# EAGLE design RasPi-BplusHAT (EAGLE 9.4.2)
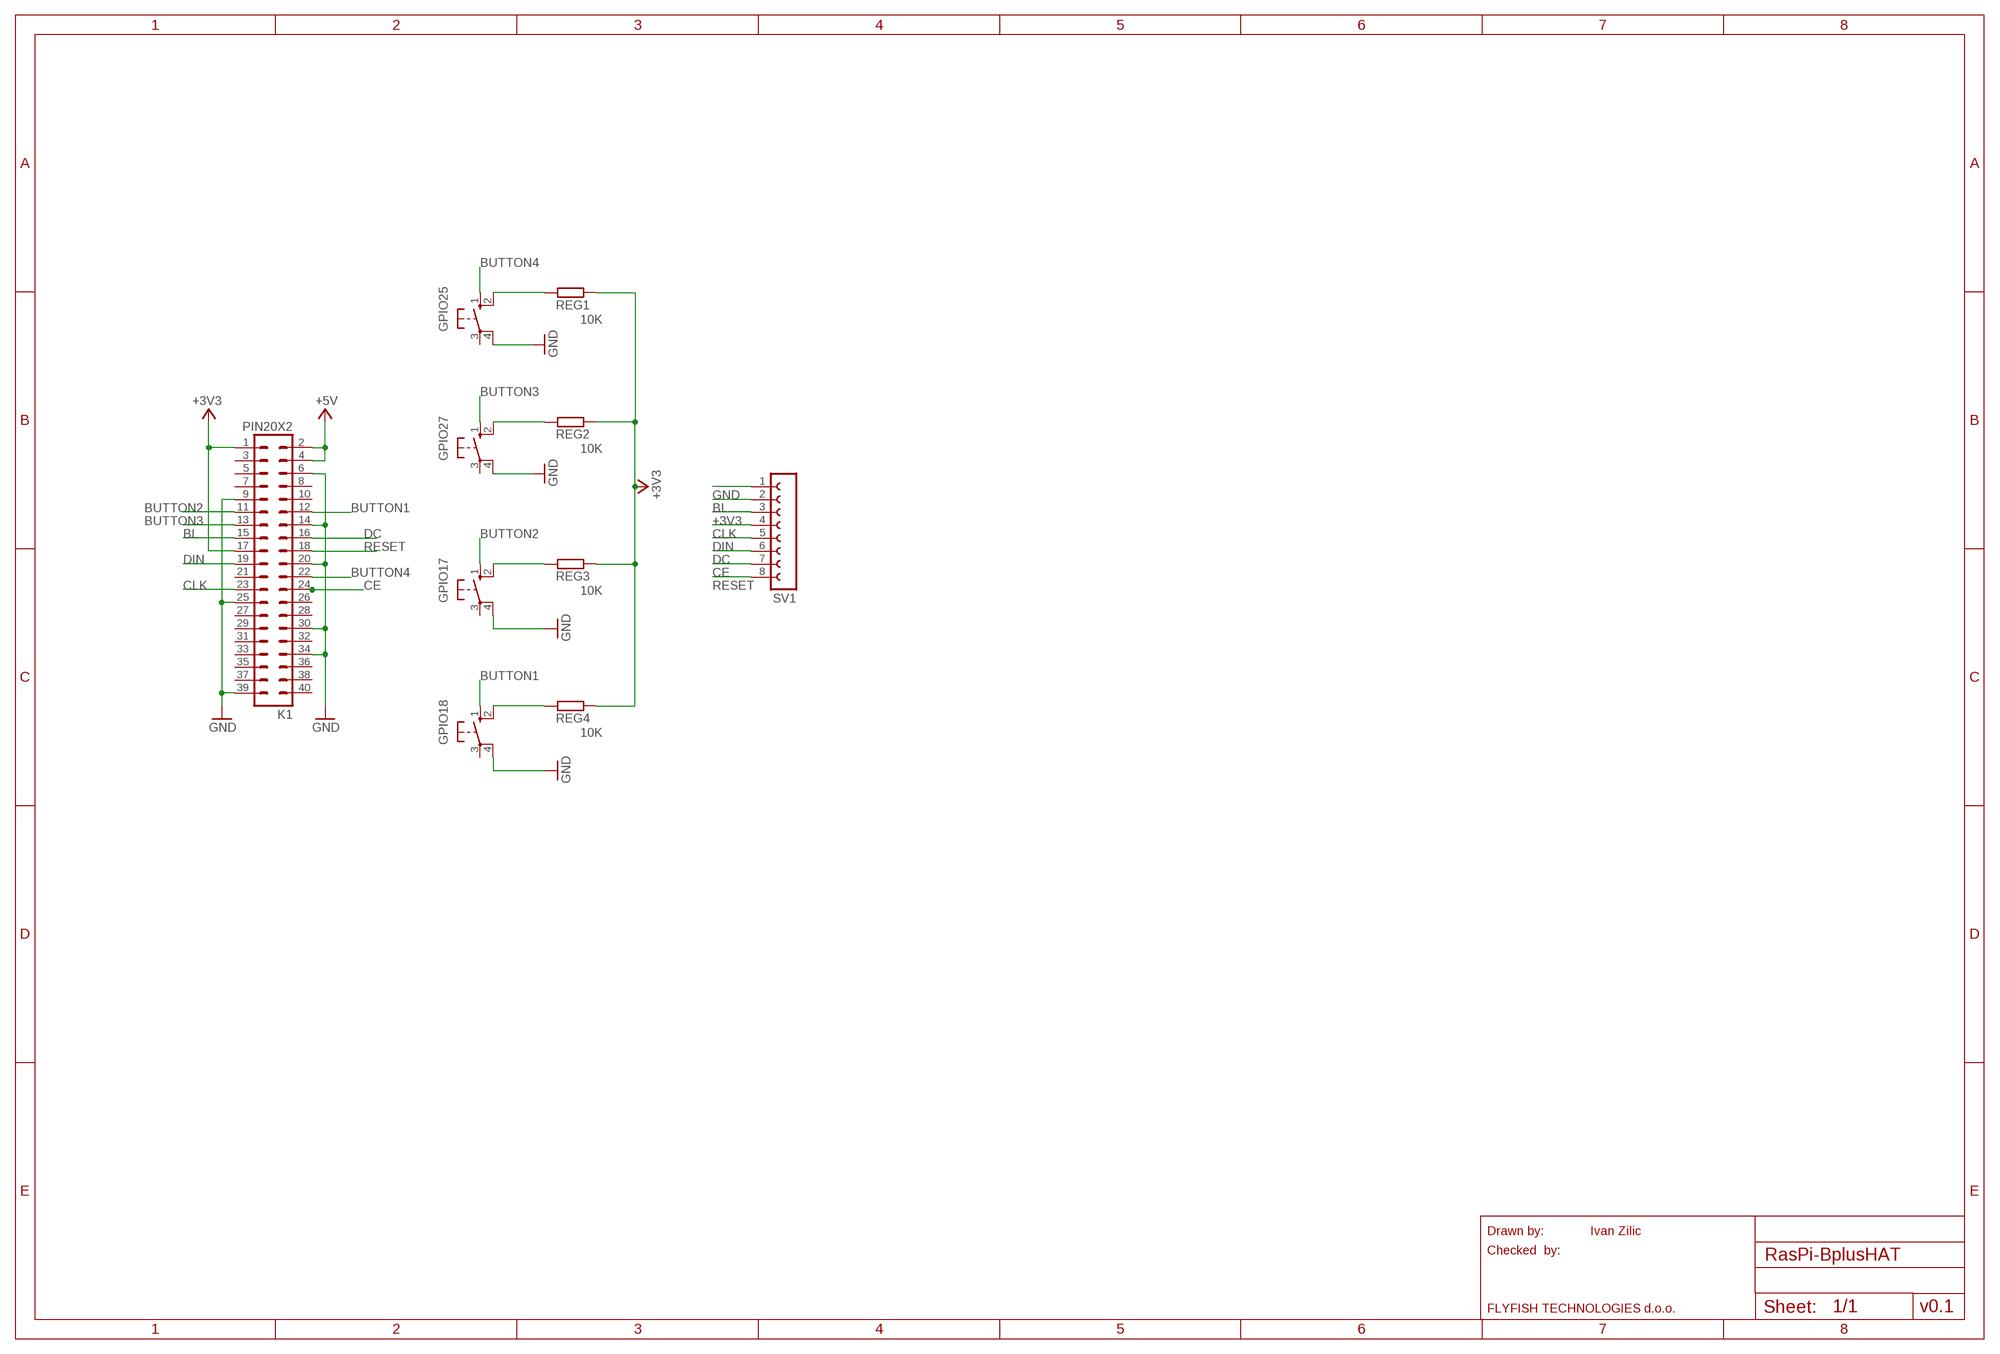
[diagram p0: schematic, sheet 1]

## Parts
GPIO17  10-XX  [B3F-10XX]
GPIO18  10-XX  [B3F-10XX]
GPIO25  10-XX  [B3F-10XX]
GPIO27  10-XX  [B3F-10XX]
K1  PIN20X2  [PIN_20X2]
REG1  10K  R-EU_0204/7  [0204/7]
REG2  10K  R-EU_0204/7  [0204/7]
REG3  10K  R-EU_0204/7  [0204/7]
REG4  10K  R-EU_0204/7  [0204/7]
SV1  FE08-1  [FE08]

## Nets
+3V3: K1.1 K1.17 REG1.1 REG2.1 REG3.1 REG4.1 SV1.3
+5V: K1.2 K1.4
BL: K1.15 SV1.2
BUTTON1: GPIO18.1(S) K1.12
BUTTON2: GPIO17.1(S) K1.11
BUTTON3: GPIO27.1(S) K1.13
BUTTON4: GPIO25.1(S) K1.22
CE: K1.24 SV1.7
CLK: K1.23 SV1.4
DC: K1.16 SV1.6
DIN: K1.19 SV1.5
GND: GPIO17.4(P1) GPIO18.4(P1) GPIO25.4(P1) GPIO27.4(P1) K1.6 K1.9 K1.14 K1.20 K1.25 K1.30 K1.34 K1.39 SV1.1
N$1: GPIO25.2(S1) REG1.2
N$2: GPIO27.2(S1) REG2.2
N$3: GPIO17.2(S1) REG3.2
N$4: GPIO18.2(S1) REG4.2
RESET: K1.18 SV1.8
Unconnected: GPIO17.3(P) GPIO18.3(P) GPIO25.3(P) GPIO27.3(P) K1.3 K1.5 K1.7 K1.8 K1.10 K1.21 K1.26 K1.27 K1.28 K1.29 K1.31 K1.32 K1.33 K1.35 K1.36 K1.37 K1.38 K1.40

## Notes on the sheet
- Drawn by: | Ivan Zilic
- Checked  by:
- FLYFISH TECHNOLOGIES d.o.o. | v0.1

## Library data of the parts
GPIO17 GPIO18 GPIO25 GPIO27 = switch-omron:10-XX: OMRON SWITCH; MPN: B3F-1000; OC_FARNELL: 176432; OC_NEWARK: 36M3542
K1 = FLYFISH:PIN20X2
REG1-REG4 = resistor:R-EU_: RESISTOR, European symbol
SV1 = con-lsta:FE08-1: FEMALE HEADER; OC_FARNELL: unknown; OC_NEWARK: unknown

## Net classes
0 default: width 0.305 mm, drill 0.381 mm, clearance 0.305 mm

## Board
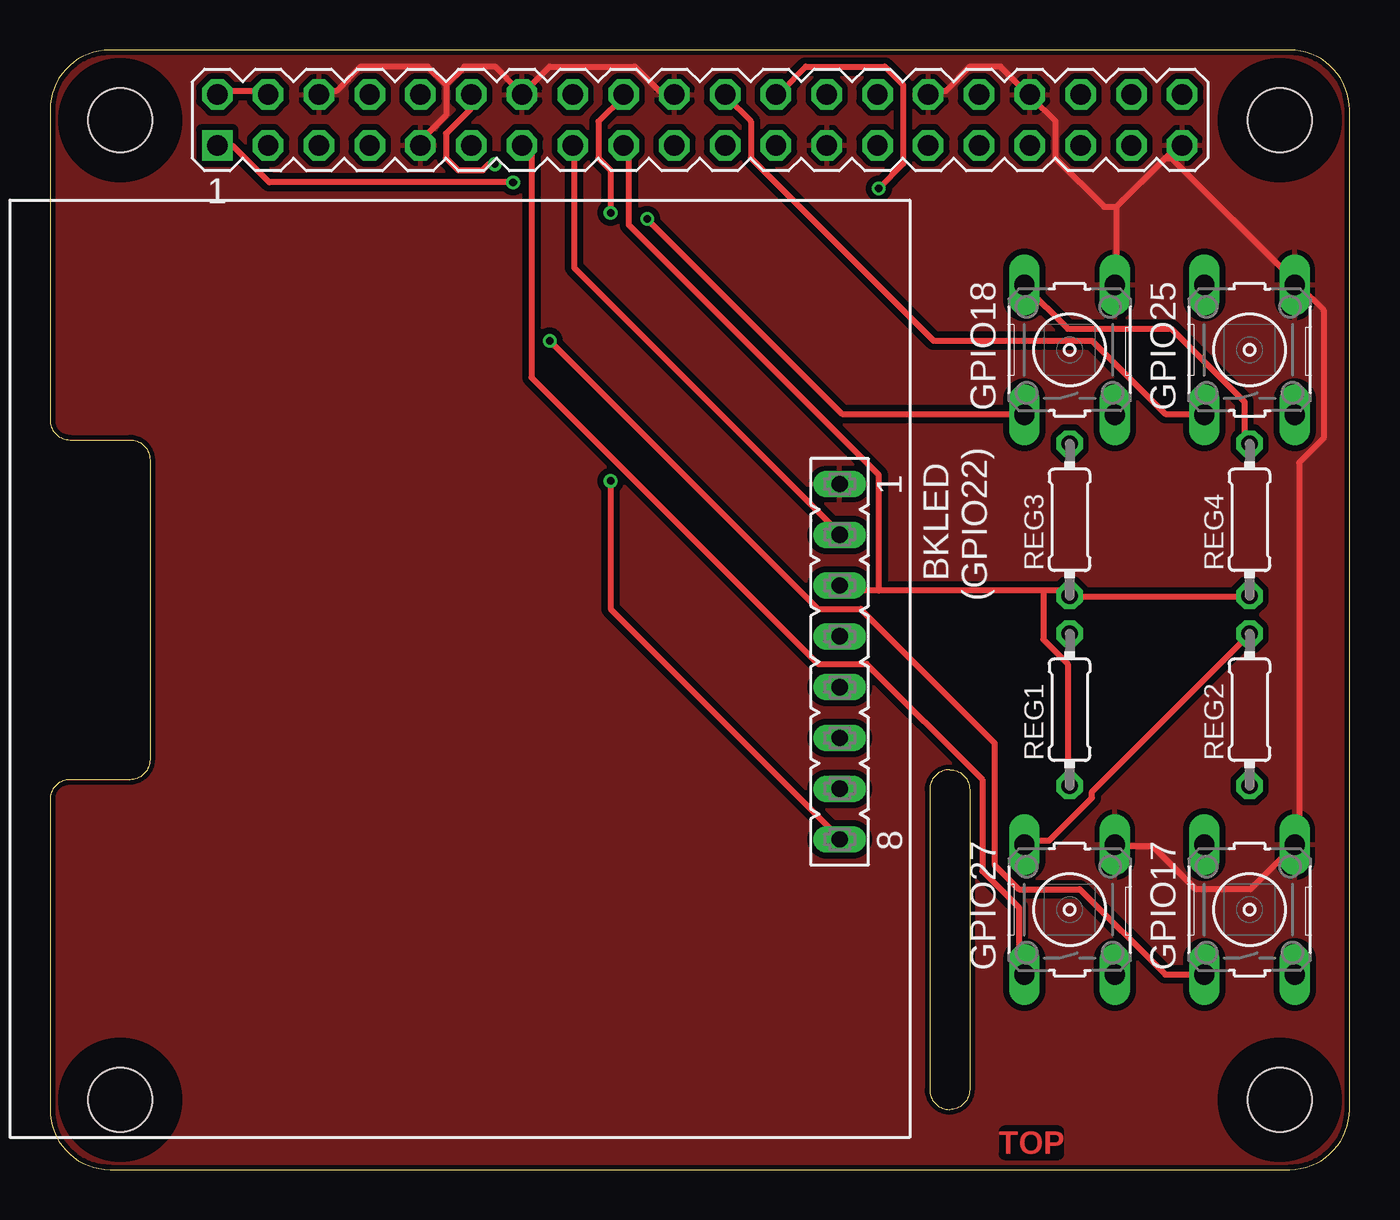
[diagram p1: board, top side]
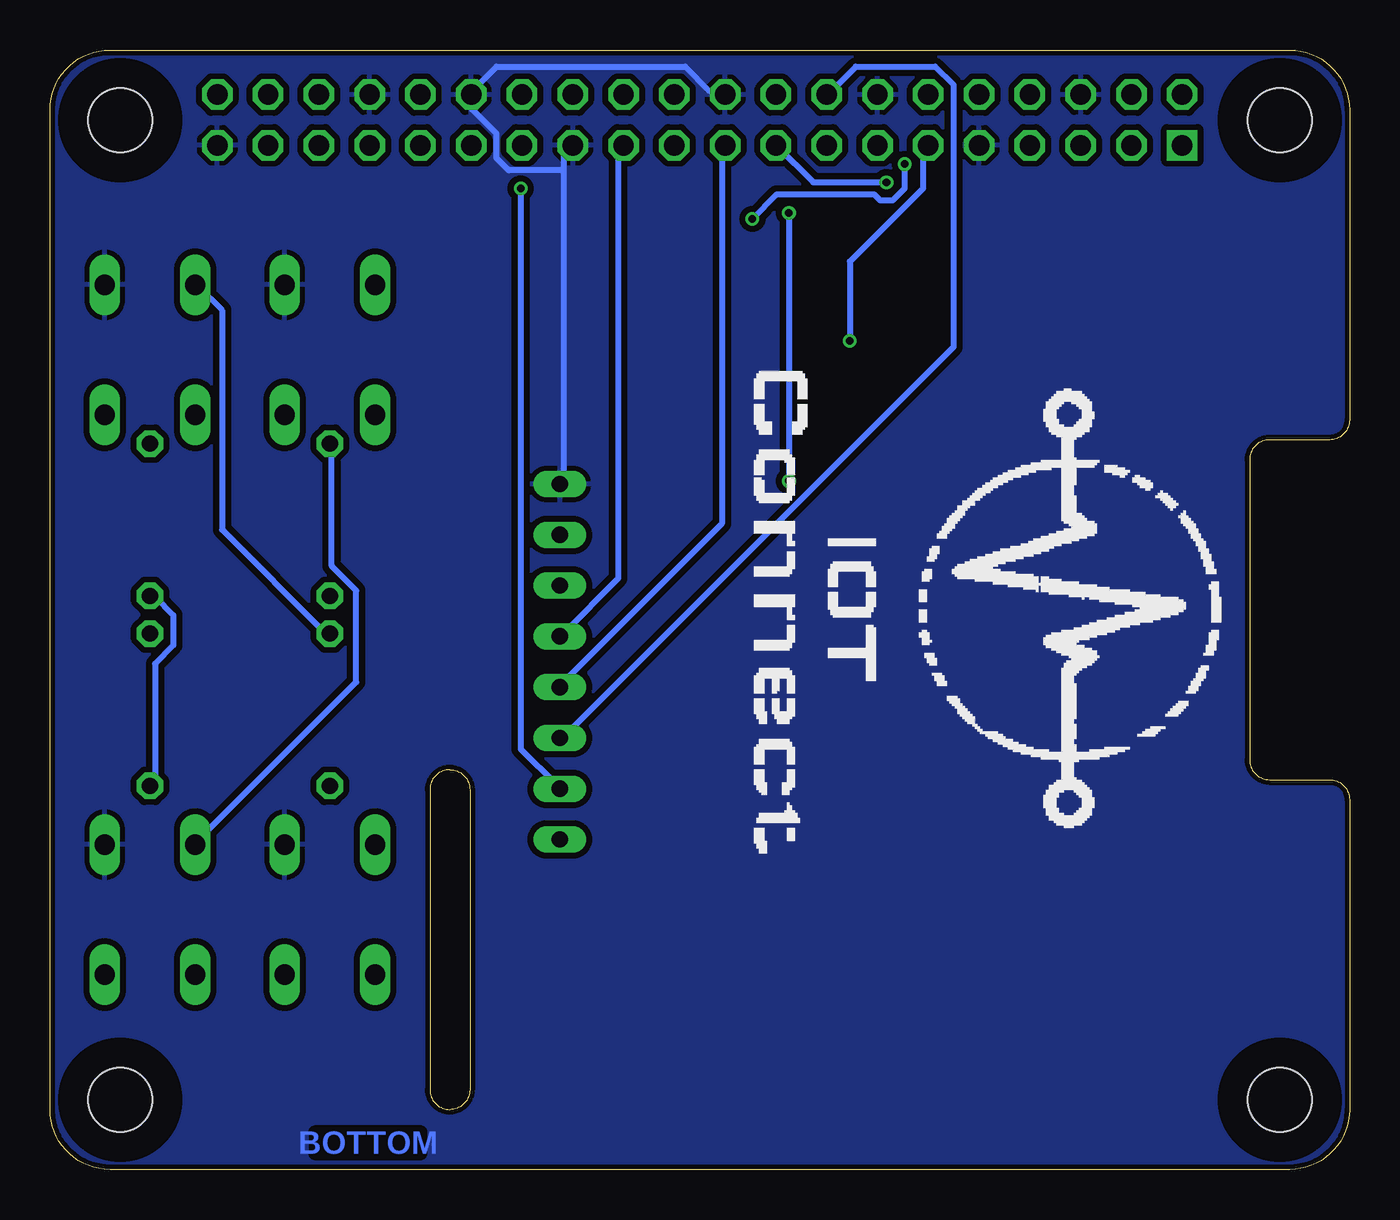
[diagram p2: board, bottom side, seen from below]

Size 65 x 56 mm. Coordinates in mm from the lower left corner, seen from the top.
Outline: 0,3 arc90 3,0 62,0 arc90 65,3 65,53 arc90 62,56 3,56 arc90 0,53 0,37.5 arc90 1,36.5 4,36.5 arc-90 5,35.5 5,20.5 arc-90 4,19.5 1,19.5 arc90 0,18.5 0,3
Outline: 44,19 44,4 arc90 45,3 arc90 46,4 46,19 arc90 45,20 arc90 44,19
Copper layers (1*16): Top 0.035mm / dielectric 1.5mm / Bottom 0.035mm
Design rules "ITEADstudio_DRC": minimum track width 6mil, minimum drill 12mil, track to track 6mil, track to pad 6mil, pad to pad 6mil, via to via 6mil, smd to smd 0mil, copper to edge 10mil, drill to drill 10mil, minimum pad ring 10mil, minimum via ring 6mil, stop-mask expansion 2mil, vias tented up to drill 100mil, thermal gap 10mil
Holes 3.2 mm at 3.5,3.5 3.5,52.5 61.5,52.5 61.5,3.5
tRestrict: area 1.9,51 to 5,54; area 60,51 to 63,54; area 60,1.9 to 63,5; area 1.9,1.9 to 5,5
bRestrict: area 1.9,1.9 to 5,5; area 1.9,51 to 5,54; area 60,1.9 to 63,5; area 60,51 to 63,54
Milling: 6 lines

### Footprints (pad centres in the part's own frame; a part is rotated, then mirrored left to right if it is on the bottom)
B3F-10XX = drill 1.016 long: 1 -3.251,2.261; 2 3.251,2.261; 3 -3.251,-2.261; 4 3.251,-2.261
PIN_20X2 = drill 1.016 square: 1 -24.13,-1.27 | drill 1.016 octagon: 2 -24.13,1.27; 3 -21.59,-1.27; 4 -21.59,1.27; 5 -19.05,-1.27; 6 -19.05,1.27; 7 -16.51,-1.27; 8 -16.51,1.27; 9 -13.97,-1.27; 10 -13.97,1.27; 11 -11.43,-1.27; 12 -11.43,1.27; 13 -8.89,-1.27; 14 -8.89,1.27; 15 -6.35,-1.27; 16 -6.35,1.27; 17 -3.81,-1.27; 18 -3.81,1.27; 19 -1.27,-1.27; 20 -1.27,1.27; 21 1.27,-1.27; 22 1.27,1.27; 23 3.81,-1.27; 24 3.81,1.27; 25 6.35,-1.27; 26 6.35,1.27; 27 8.89,-1.27; 28 8.89,1.27; 29 11.43,-1.27; 30 11.43,1.27; 31 13.97,-1.27; 32 13.97,1.27; 33 16.51,-1.27; 34 16.51,1.27; 35 19.05,-1.27; 36 19.05,1.27; 37 21.59,-1.27; 38 21.59,1.27; 39 24.13,-1.27; 40 24.13,1.27
0204/7 = drill 0.813 octagon: 1 -3.81,0; 2 3.81,0
FE08 = drill 0.813 long: 1 -8.89,0; 2 -6.35,0; 3 -3.81,0; 4 -1.27,0; 5 1.27,0; 6 3.81,0; 7 6.35,0; 8 8.89,0

### Placement (x,y rotation side)
GPIO17  60,13 90 top
GPIO18  51,41 90 top
GPIO25  60,41 90 top
GPIO27  51,13 90 top
K1  32.5,52.5 0 top
REG1  51,23 90 top
REG2  60,23 90 top
REG3  51,32.5 90 top
REG4  60,32.5 90 top
SV1  39.5,25.4 270 top

### Tracks (layer width: path | path; a pad name or v marks a point on that pad's centre or on a via)
+3V3  (via drill 0.38)
  Top 0.305: v23.16,49.38 10.97,49.38 9.14,51.21 8.53,51.21 K1.1 | 49.68,28.96 50.9,28.96 REG3.1 51.21,28.65 59.74,28.65 REG4.1 | 49.68,28.96 41.45,28.96 | 41.45,28.96 39.62,28.96 SV1.3 | 49.68,28.96 49.68,26.52 50.9,25.3 50.9,19.2 REG1.1 | 41.45,28.96 41.45,34.75 28.96,47.24 28.96,51.21 K1.17
  Bottom 0.305: v23.16,49.38 26.82,49.38 28.65,51.21 K1.17 | REG2.1 59.74,19.2 59.74,25.3 58.83,26.21 58.83,27.74 59.74,28.65 REG4.1
+5V
  Top 0.305: K1.2 8.53,53.95 10.67,53.95 K1.4
BL
  Top 0.305: SV1.2 39.32,32 26.21,45.11 26.21,51.21 K1.15
BUTTON1  (via drill 0.38)
  Top 0.305: v29.87,47.55 39.62,37.8 48.46,37.8 GPIO18.1 | v22.25,50.29 21.95,50.29 21.64,49.99 20.42,49.99 19.81,50.6 19.81,51.82 21.03,53.03 21.03,53.65 K1.12
  Bottom 0.305: v29.87,47.55 28.65,48.77 23.77,48.77 23.47,48.46 22.86,48.46 22.25,49.07 v22.25,50.29
BUTTON2  (via drill 0.38)
  Top 0.305: v24.99,41.45 38.41,28.04 40.54,28.04 47.24,21.34 47.24,15.24 48.46,14.02 51.51,14.02 55.78,9.75 57.61,9.75 GPIO17.1
  Bottom 0.305: v24.99,41.45 24.99,45.41 21.34,49.07 21.34,51.21 K1.11
BUTTON3
  Top 0.305: GPIO27.1 48.46,9.75 48.46,13.11 46.63,14.94 46.63,19.51 40.84,25.3 38.41,25.3 24.08,39.62 24.08,50.9 23.77,51.21 K1.13
BUTTON4
  Top 0.305: GPIO25.1 57.61,37.8 55.78,37.8 52.12,41.45 44.2,41.45 35.05,50.6 35.05,52.43 33.83,53.65 K1.22
CE  (via drill 0.38)
  Top 0.305: v41.45,49.07 42.67,50.29 42.67,54.25 41.76,55.17 37.8,55.17 36.58,53.95 K1.24
  Bottom 0.305: v41.45,49.07 41.45,21.03 39.62,19.2 SV1.7
CLK
  Bottom 0.305: SV1.4 39.32,26.82 36.58,29.57 36.58,51.21 K1.23
DC
  Bottom 0.305: SV1.6 39.32,21.64 19.81,41.15 19.81,54.25 20.73,55.17 24.69,55.17 25.91,53.95 K1.16
DIN
  Bottom 0.305: SV1.5 39.32,24.38 31.39,32.31 31.39,51.21 K1.19
GND
  Top 0.305: GPIO27.4 53.34,16.15 55.17,16.15 57.3,14.02 60.05,14.02 62.18,16.15 GPIO17.4 62.48,16.46 62.48,35.36 63.7,36.58 63.7,42.98 62.48,44.2 GPIO25.4 62.18,44.5 56.08,50.6 55.78,50.6 | 53.34,48.16 53.34,44.5 GPIO18.4 | 55.78,50.6 56.39,51.21 K1.39 | 55.78,50.6 53.34,48.16 | 19.81,54.25 19.81,52.73 18.59,51.51 K1.9 | 19.81,54.25 20.73,55.17 22.25,55.17 23.47,53.95 K1.14 23.77,53.95 24.99,55.17 29.26,55.17 30.48,53.95 31.09,53.95 K1.20 | 19.81,54.25 18.9,55.17 15.54,55.17 14.33,53.95 13.72,53.95 K1.6 | K1.30 44.2,53.95 44.81,53.95 46.02,55.17 47.55,55.17 48.77,53.95 K1.34 49.07,53.65 50.29,52.43 50.29,50.6 52.73,48.16 53.34,48.16
  Bottom 0.305: 39.32,49.99 39.32,50.9 39.01,51.21 K1.25 | 39.32,49.99 39.32,34.44 SV1.1 | 39.32,49.99 42.06,49.99 42.67,50.6 42.67,51.82 43.89,53.03 43.89,53.65 K1.30 43.89,53.95 42.67,55.17 33.22,55.17 32,53.95 31.39,53.95 K1.20
  pour Top: 0.13,56.39 64.26,56.39 66.17,54.48 66.17,1.78 63.75,-0.64 1.52,-0.64 -0.51,1.4 -0.51,55.5 0.13,56.13
  pour Bottom: 0.13,56.39 64.26,56.39 66.17,54.48 66.17,1.78 63.75,-0.64 1.52,-0.64 -0.51,1.4 -0.51,55.75
N$1
  Bottom 0.305: REG1.2 51.21,26.82 56.39,32 56.39,42.98 57.61,44.2 GPIO25.2
N$2
  Top 0.305: REG2.2 59.74,26.52 52.12,18.9 52.12,18.59 49.99,16.46 48.77,16.46 GPIO27.2
N$3
  Bottom 0.305: REG3.2 50.9,36.27 50.9,30.18 49.68,28.96 49.68,24.38 57.61,16.46 GPIO17.2
N$4
  Top 0.305: REG4.2 59.74,36.58 59.74,38.41 56.08,42.06 50.9,42.06 48.77,44.2 GPIO18.2
RESET  (via drill 0.38)
  Top 0.305: v28.04,34.44 28.04,28.04 39.32,16.76 SV1.8 | v28.04,47.85 28.04,49.99 27.43,50.6 27.43,52.43 28.65,53.65 K1.18
  Bottom 0.305: v28.04,47.85 v28.04,34.44

### Text on the board
Top: TOP
Bottom: BOTTOM
tNames: BKLED / (GPIO22)